# EAGLE schematic esp32-mqtt-door-opener (EAGLE 9.6.2)
CREVISION: 4.0; DESIGNER: jkhsjdhjs
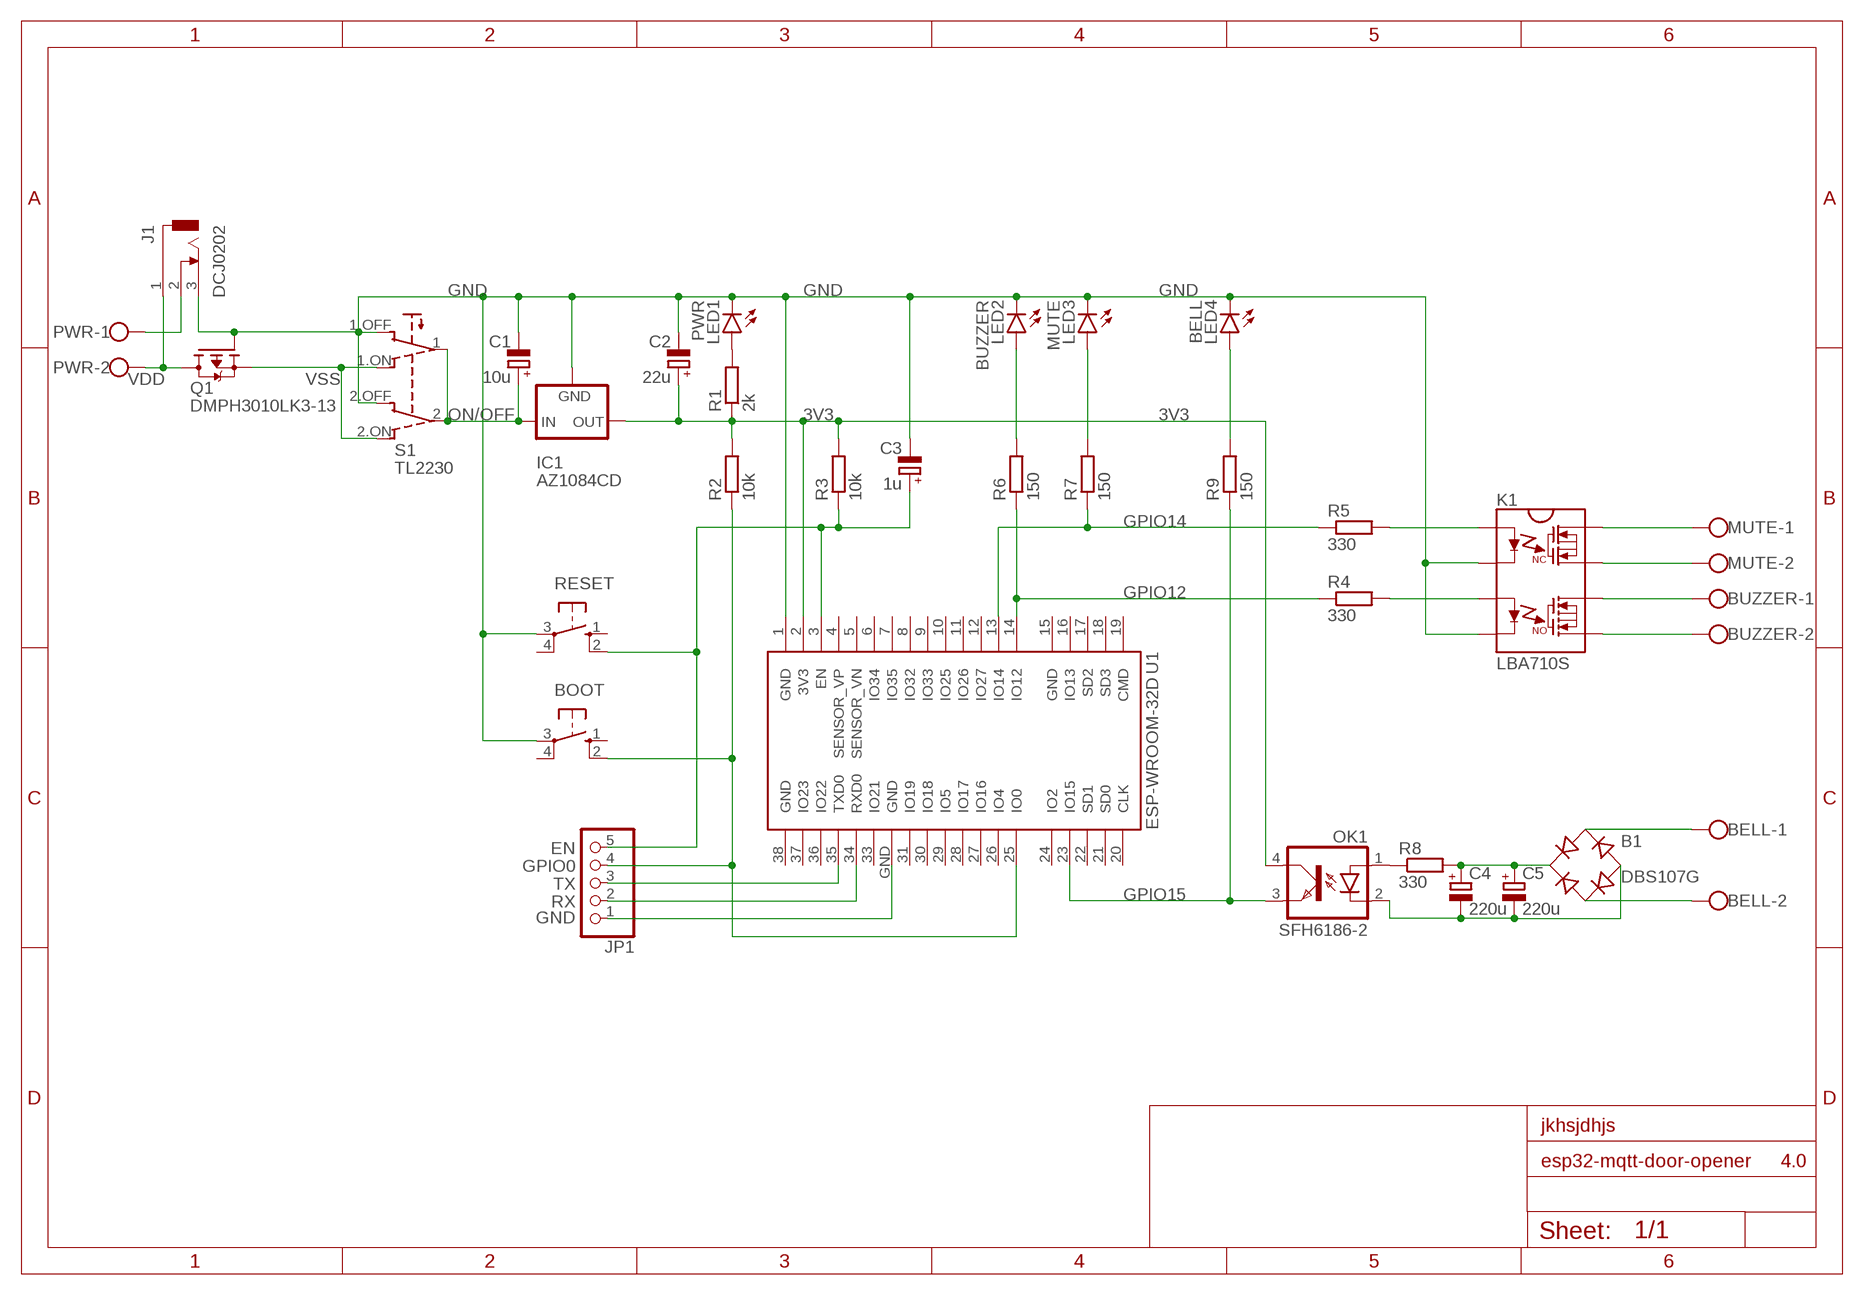
[diagram p0: schematic, sheet 1]

## Parts
B1  DBS107G  [DBS]
BELL  W237-102  [W237-102]
BOOT  10-XX  [B3F-10XX]
BUZZER  W237-102  [W237-102]
C1  10u  CPOL-EUC/6032-28R  [C/6032-28R]
C2  22u  CPOL-EUC/6032-28R  [C/6032-28R]
C3  1u  CPOL-EUA/3216-18R  [A/3216-18R]
C4  220u  CPOL-EUD/7343-31R  [D/7343-31R]
C5  220u  CPOL-EUD/7343-31R  [D/7343-31R]
IC1  AZ1084CD  [DPAK]
J1  DCJ0202  [DCJ0202]
JP1  PINHD-1X5  [1X05]
K1  LBA710S  [DIP8]
LED1  PWR  LEDSMT1206  [1206]
LED2  BUZZER  LEDSMT1206  [1206]
LED3  MUTE  LEDSMT1206  [1206]
LED4  BELL  LEDSMT1206  [1206]
MUTE  W237-102  [W237-102]
OK1  SFH6186-2  [SMD4-7]
PWR  W237-102  [W237-102]
Q1  DMPH3010LK3-13  FDD4141TO252  [TO252]
R1  2k  R-EU_R0603  [R0603]
R2  10k  R-EU_R0603  [R0603]
R3  10k  R-EU_R0603  [R0603]
R4  330  R-EU_R0603  [R0603]
R5  330  R-EU_R0603  [R0603]
R6  150  R-EU_R0603  [R0603]
R7  150  R-EU_R0603  [R0603]
R8  330  R-EU_R0603  [R0603]
R9  150  R-EU_R0603  [R0603]
RESET  10-XX  [B3F-10XX]
S1  TL2230  [TL2230]
U1  ESP-WROOM-32D  ESP-WROOM-32  [ESP-WROOM-32]

## Nets
3V3: C2.+ IC1.3(OUT) OK1.4(COL) R1.1 R2.2 R3.2 U1.2(3V3)
EN: C3.+ JP1.5 R3.1 RESET.2(S1) U1.3(EN)
GND: BOOT.3(P) C1.- C2.- C3.- IC1.1(GND) J1.3 JP1.1 K1.2(NC-CONTROL-) K1.4(NO-CONTROL-) LED1.C LED2.C LED3.C LED4.C Q1.1(G) RESET.3(P) S1.1.OFF S1.2.OFF U1.1(GND) U1.GND
GPIO0: BOOT.2(S1) JP1.4 R2.1 U1.25(IO0)
GPIO12: R4.1 R6.1 U1.14(IO12)
GPIO14: R5.1 R7.1 U1.13(IO14)
GPIO15: OK1.3(EMIT) R9.1 U1.23(IO15)
N$1: LED1.A R1.2
N$3: K1.3(NO-CONTROL+) R4.2
N$4: LED3.A R7.2
N$5: K1.1(NC-CONTROL+) R5.2
N$6: LED2.A R6.2
N$8: B1.AC1 BELL.1
N$9: K1.8(NC-OUT1) MUTE.1
N$10: K1.7(NC-OUT2) MUTE.2
N$11: BUZZER.1 K1.6(NO-OUT1)
N$12: BUZZER.2 K1.5(NO-OUT2)
N$13: B1.AC2 BELL.2
N$15: B1.+ C4.+ C5.+ R8.2
N$16: B1.- C4.- C5.- OK1.2(C)
N$17: OK1.1(A) R8.1
N$18: LED4.A R9.2
N$20: J1.2 PWR.1
ON/OFF: C1.+ IC1.2(IN) S1.1 S1.2
RX: JP1.2 U1.34(RXD0)
TX: JP1.3 U1.35(TXD0)
VDD: J1.1 PWR.2 Q1.3(D)
VSS: Q1.2(S) S1.1.ON S1.2.ON
Unconnected: BOOT.1(S) BOOT.4(P1) RESET.1(S) RESET.4(P1) U1.4(SENSOR_VP) U1.5(SENSOR_VN) U1.6(IO34) U1.7(IO35) U1.8(IO32) U1.9(IO33) U1.10(IO25) U1.11(IO26) U1.12(IO27) U1.16(IO13) U1.17(SD2) U1.18(SD3) U1.19(CMD) U1.20(CLK) U1.21(SD0) U1.22(SD1) U1.24(IO2) U1.26(IO4) U1.27(IO16) U1.28(IO17) U1.29(IO5) U1.30(IO18) U1.31(IO19) U1.33(IO21) U1.36(IO22) U1.37(IO23)

## Power pins joined to a net without a drawn wire
GND: U1.15(GND) U1.38(GND)

## Library data of the parts
B1 = rectifier:DB?*G: Single Phase 1.0 AMP Glass Passivated Bridge Rectifier Taiwan Semiconductor Co.,Ltd. - TSC Source: http://www.taiwansemi.com/TSCbig5/ezcatfiles/cust/img/img/db101g.pdf http://www.ts.com.tw/db/pictures/modules/PDT/PDT060207001/DBLS201G.pdf
BELL BUZZER MUTE PWR = con-wago-500:W237-102: WAGO SCREW CLAMP; MPN: 237-102; OC_FARNELL: unknown; OC_NEWARK: 70K9898
BOOT RESET = switch-omron:10-XX: OMRON SWITCH; MPN: B3F-1000; OC_FARNELL: 176432; OC_NEWARK: 36M3542
C1-C5 = rcl:CPOL-EU: POLARIZED CAPACITOR, European symbol; SPICEPREFIX: C
IC1 = AZ1084C:AZ1084C: AZ1084C Series LOD Voltage Regulator Datasheet: https://www.diodes.com/assets/Datasheets/AZ1084C.pdf
J1 = con-jack:DCJ0202: DC POWER JACK Source: DCJ0202.pdf; OC_FARNELL: unknown; OC_NEWARK: unknown
JP1 = pinhead:PINHD-1X5: PIN HEADER
K1 = LBA710:LBA710: LBA710 60V Dual Single-Pole OptoMOS® Relay Normally Open & Normally Closed
LED1-LED4 = led:LED: LED OSRAM: - CHIPLED LG R971, LG N971, LY N971, LG Q971, LY Q971, LO R971, LY R971 LH N974, LH R974 LS Q976, LO Q976, LY Q976 LO Q996 - Hyper CHIPLED LW Q18S LB Q993, LB Q99A, LB R99A - SideLED LS A670, LO A670, LY A670, LG A670, LP A670 LB A673, LV A673, LT A673, LW A673 LH A674 LY A675 LS A676, LA A676, LO A676, LY A676, LW A676 LS A679, LY A679, LG A679 - Hyper Micro SIDELED® LS Y876, LA Y876, LO Y876, LY Y876 LT Y87S - SmartLED LW L88C, LW L88S LB L89C, LB L89S, LG L890 LS L89K, LO L89K, LY L89K LS L896, LA L896, LO L896, LY L896 - TOPLED LS T670, LO T670, LY T670, LG T670, LP T670 LSG T670, LSP T670, LSY T670, LOP T670, LYG T670 LG T671, LOG T671, LSG T671 LB T673, LV T673, LT T673, LW T673 LH T674 LS T676, LA T676, LO T676, LY T676, LB T676, LH T676, LSB T676, LW T676 LB T67C, LV T67C, LT T67C, LS T67K, LO T67K, LY T67K, LW E67C LS E67B, LA E67B, LO E67B, LY E67B, LB E67C, LV E67C, LT E67C LW T67C LS T679, LY T679, LG T679 LS T770, LO T770, LY T770, LG T770, LP T770 LB T773, LV T773, LT T773, LW T773 LH T774 LS E675, LA E675, LY E675, LS T675 LS T776, LA T776, LO T776, LY T776, LB T776 LHGB T686 LT T68C, LB T68C - Hyper Mini TOPLED® LB M676 - Mini TOPLED Santana® LG M470 LS M47K, LO M47K, LY M47K Source: http://www.osram.convergy.de LUXEON: - LUMILED® LXK2-PW12-R00, LXK2-PW12-S00, LXK2-PW14-U00, LXK2-PW14-V00 LXK2-PM12-R00, LXK2-PM12-S00, LXK2-PM14-U00 LXK2-PE12-Q00, LXK2-PE12-R00, LXK2-PE12-S00, LXK2-PE14-T00, LXK2-PE14-U00 LXK2-PB12-K00, LXK2-PB12-L00, LXK2-PB12-M00, LXK2-PB14-N00, LXK2-PB14-P00, LXK2-PB14-Q00 LXK2-PR12-L00, LXK2-PR12-M00, LXK2-PR14-Q00, LXK2-PR14-R00 LXK2-PD12-Q00, LXK2-PD12-R00, LXK2-PD12-S00 LXK2-PH12-R00, LXK2-PH12-S00 LXK2-PL12-P00, LXK2-PL12-Q00, LXK2-PL12-R00 Source: www.luxeon.com KINGBRIGHT: KA-3528ASYC Source: www.kingbright.com
OK1 = optocoupler:SFH618?*: Optocoupler, Phototransistor Output, Low Input Current Source: Data sheet <http://www.vishay.com/docs/83673/sfh618.pdf>; MF: VISHAY/TELEFUNKEN; MPN: SFH6186-2; OC_FARNELL: 1469583; OC_NEWARK: 58K2210
Q1 = transistor-fet:FDD4141: P-Channel PowerTrench® MOSFET Source: FDD4141.pdf
R1-R9 = rcl:R-EU_: RESISTOR, European symbol; SPICEPREFIX: R
S1 = TL2230:TL2230: TL2230 Sub-Miniature Pushbutton Switch Datasheet: https://datasheet.octopart.com/TL2201OAYA-E-Switch-datasheet-119046.pdf
U1 = esp32:ESP-WROOM-32: Espressif Systems ESP-WROOM-32